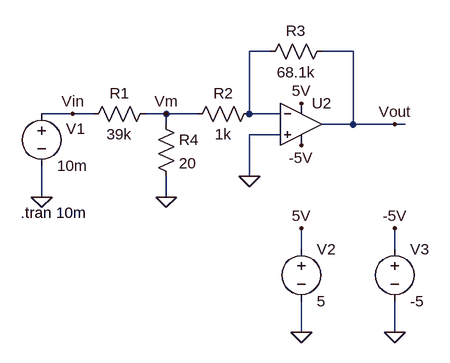
[diagram p0: schematic Draft2.asc]
Draft2.asc, the LTspice schematic file:
Version 4
SHEET 1 880 680
WIRE 288 48 256 48
WIRE 416 48 368 48
WIRE -16 144 -64 144
WIRE 16 144 -16 144
WIRE 128 144 96 144
WIRE 176 144 128 144
WIRE 256 144 256 48
WIRE 304 144 256 144
WIRE 128 160 128 144
WIRE 416 160 416 48
WIRE 416 160 368 160
WIRE 480 160 416 160
WIRE 496 160 480 160
WIRE 304 176 256 176
WIRE 256 240 256 176
WIRE -64 272 -64 224
WIRE 128 272 128 240
WIRE 336 352 336 320
WIRE 480 352 480 320
WIRE 336 480 336 432
WIRE 480 480 480 432
FLAG -64 272 0
FLAG 256 240 0
FLAG 128 272 0
FLAG 336 480 0
FLAG 480 480 0
FLAG 336 320 5V
FLAG 480 320 -5V
FLAG 336 128 5V
FLAG 336 192 -5V
FLAG 480 160 Vout
FLAG -16 144 Vin
FLAG 128 144 Vm
SYMBOL voltage -64 128 R0
WINDOW 0 38 39 Left 2
SYMATTR InstName V1
SYMATTR Value 10m
SYMBOL res 112 128 R90
WINDOW 0 0 56 VBottom 2
WINDOW 3 32 56 VTop 2
SYMATTR InstName R1
SYMATTR Value 39k
SYMBOL res 272 128 R90
WINDOW 0 0 56 VBottom 2
WINDOW 3 32 56 VTop 2
SYMATTR InstName R2
SYMATTR Value 1k
SYMBOL res 384 32 R90
WINDOW 0 0 56 VBottom 2
WINDOW 3 32 56 VTop 2
SYMATTR InstName R3
SYMATTR Value 68.1k
SYMBOL res 112 144 R0
SYMATTR InstName R4
SYMATTR Value 20
SYMBOL OpAmps\\UniversalOpAmp2 336 160 R0
SYMATTR InstName U2
SYMBOL voltage 336 336 R0
SYMATTR InstName V2
SYMATTR Value 5
SYMBOL voltage 480 336 R0
SYMATTR InstName V3
SYMATTR Value -5
TEXT -96 296 Left 2 !.tran 10m

The netlist it stands for:
* Draft2.asc
V1 Vin 0 10m
R1 Vm Vin 39k
R2 N001 Vm 1k
R3 Vout N001 68.1k
R4 Vm 0 20
XU2 0 N001 5V -5V Vout level2 Avol=1Meg GBW=10Meg Slew=10Meg Ilimit=25m Rail=0 Vos=0 En=0 Enk=0 In=0 Ink=0 Rin=500Meg  ; pins In+ In- V+ V- OUT
V2 5V 0 5
V3 -5V 0 -5
.tran 10m
.lib UniversalOpAmp2.lib
.backanno
.end